# EasyEDA Pro project stm32最小系统板.eprj

# Schematic Schematic1
Create Date: 2024-04-08; Page Name: P1; Project Name: stm32最小系统板; Schematic Name: Schematic1; Update Date: 2024-06-23; Company: 无; Page Size: A4; Version: V1.0
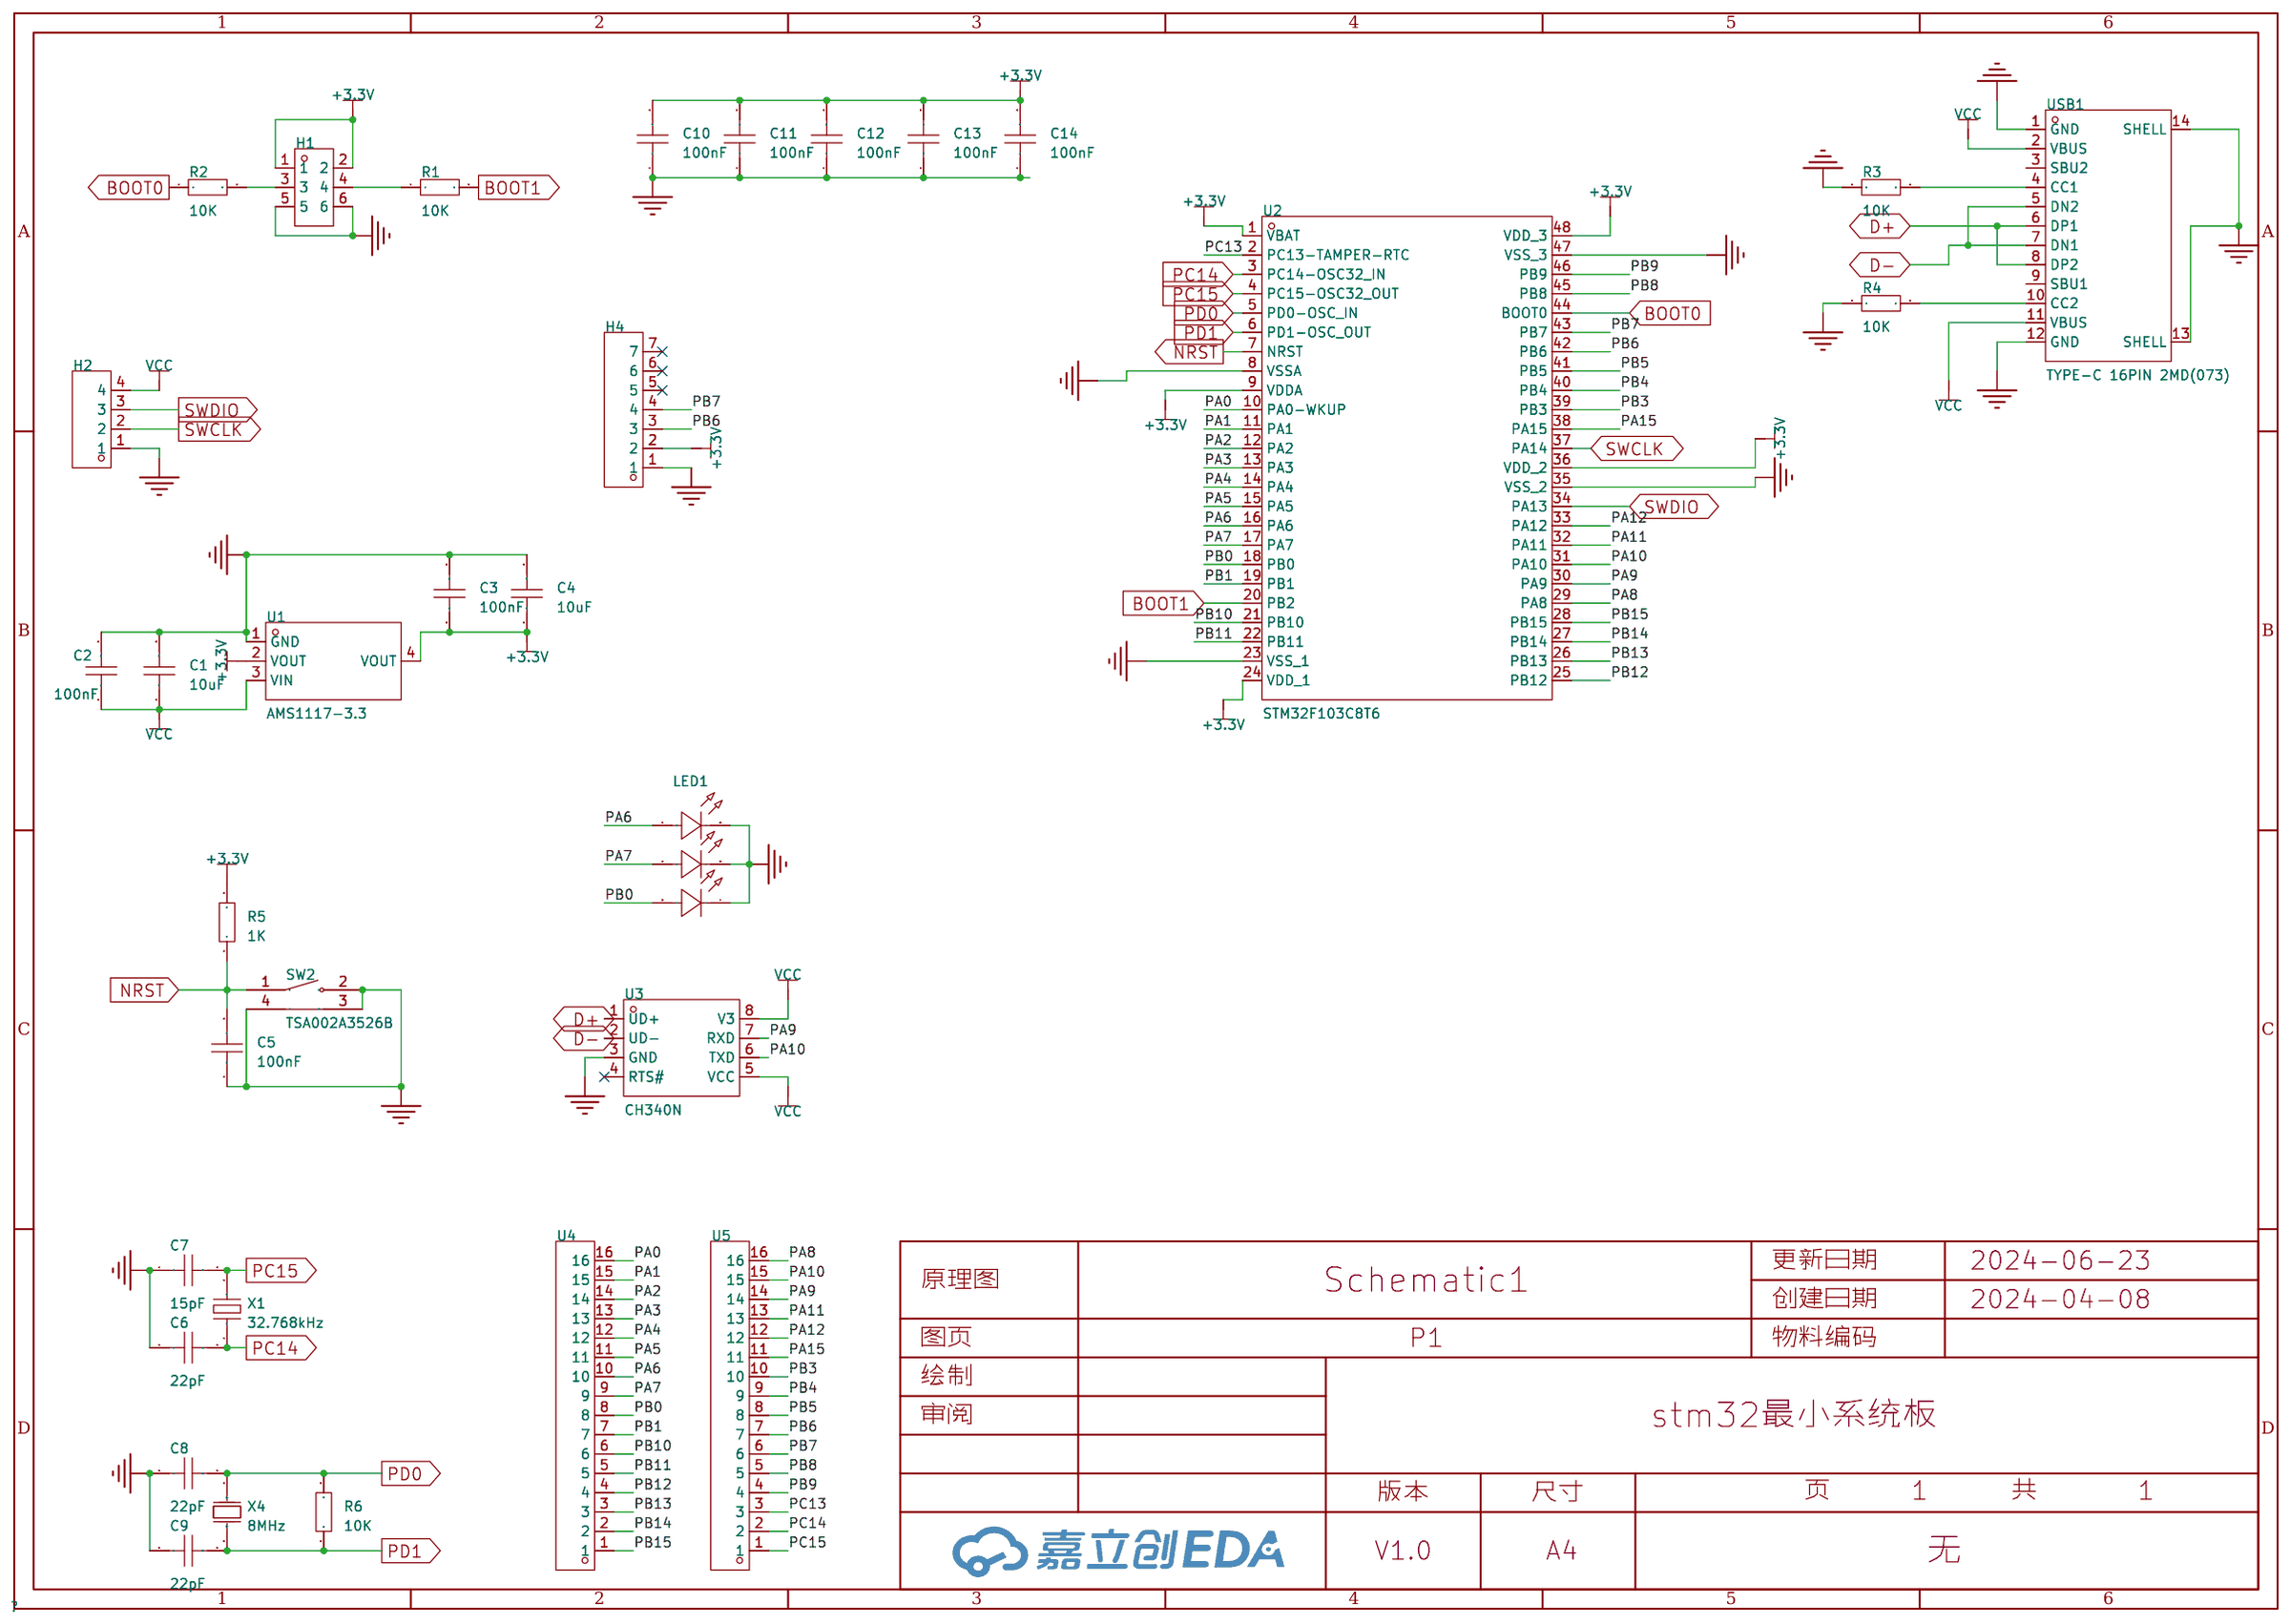
[diagram p0: schematic sheet]

## Parts
C1  10uF  [C0603]
C2  100nF  [C0603]
C3  100nF  [C0603]
C4  10uF  [C0603]
C5  100nF  [C0603]
C6  22pF  [C0603]
C7  15pF  [C0603]
C8  22pF  [C0603]
C9  22pF  [C0603]
C10  100nF  [C0603]
C11  100nF  [C0603]
C12  100nF  [C0603]
C13  100nF  [C0603]
C14  100nF  [C0603]
H1  PZ254V-12-6P  [HDR-TH_6P-P2.54-V-M-R2-C3-S2.54]
H2  PZ254V-11-04P  [HDR-TH_4P-P2.54-V-M]
H4  PZ254V-11-07P  [HDR-TH_7P-P2.54-V-M]
LED1  TC5050RGBF08-3CJH-AF53A  [LED-SMD_6P-L5.0-W5.0-TL_TC5050RGBF08]
R1  10K  [R0603]
R2  10K  [R0603]
R3  10K  [R0603]
R4  10K  [R0603]
R5  1K  [R0603]
R6  10K  [R0603]
SW2  TSA002A3526B  [SW-SMD_TSA245G00D-250]
U1  AMS1117-3.3  [SOT-223-3_L6.5-W3.4-P2.30-LS7.0-BR]
U2  STM32F103C8T6  [LQFP-48_L7.0-W7.0-P0.50-LS9.0-BL]
U3  CH340N  [SOP-8_L4.9-W3.9-P1.27-LS6.0-BL]
U4  ZX-PZ2.54-1-16PZZ  [HDR-TH_16P-P2.54-V-M-2]
U5  ZX-PZ2.54-1-16PZZ  [HDR-TH_16P-P2.54-V-M-2]
USB1  TYPE-C 16PIN 2MD(073)  [USB-C-SMD_TYPE-C-6PIN-2MD-073]
X1  32.768kHz  [OSC-SMD_L3.2-W1.5]
X4  8MHz  [CRYSTAL-SMD_L11.5-W4.8-LS12.7]

## Library data of the parts
C1-C14 = CAP_0603: Supplier Footprint: 0603
H1 = PZ254V-12-6P: 插针结构:2x3P;间距:2.54mm;行距:2.54mm;圆针/方针:方针;安装类型:直插;排数:双排;总PIN位数:6P;额定电流:-;额定电压:-;配合针长度:6mm;塑高:2.5mm;端接针长度:3mm;触头材质:黄铜;触头镀层:-;工作温度范围:-40℃~+105℃;颜色:黑色;; LCSC Part Name: 间距:2.54mm 2x3P 直插 方针; Supplier Part: C492420; Manufacturer: XFCN(兴飞); Supplier Footprint: 插件,P=2.54mm; JLCPCB Part Class: 扩展库; Datasheet: https://atta.szlcsc.com/upload/public/pdf/source/20200309/C492420_BAECB307B001054C09D200388220EAE6.pdf; Supplier: LCSC; Pin Structure: 2x3P; Pitch: 2.54mm; Row Spacing: 2.54mm; Circluar Pins/Square Pins: 方针; Mounting Type: 直插; Number of Rows: 双排; Number of Pins: 6P; Length of Mating Pin: 6mm; Insulation Height: 2.5mm; Length of End Connection Pin: 3mm; Contact Material: 黄铜; Operating Temperature Range: -40℃~+105℃; Color: 黑色
H2 = PZ254V-11-04P: 插针结构:1x4P;间距:2.54mm;行距:-;圆针/方针:方针;安装类型:直插;排数:单排;总PIN位数:4P;额定电流:3A;额定电压:250V;配合针长度:6mm;塑高:2.5mm;端接针长度:3mm;触头材质:-;工作温度范围:-40℃~+105℃;颜色:黑色;; LCSC Part Name: 间距:2.54mm 1x4P 直插 方针; Supplier Part: C2691448; Manufacturer: XFCN(兴飞); Supplier Footprint: 插件,P=2.54mm; JLCPCB Part Class: 扩展库; Datasheet: https://atta.szlcsc.com/upload/public/pdf/source/20200309/C492403_F9F19131791D08044AD4F84F8E751A34.pdf; Supplier: LCSC; Pin Structure: 1x4P; Pitch: 2.54mm; Circluar Pins/Square Pins: 方针; Mounting Type: 直插; Number of Rows: 单排; Number of Pins: 4P; Current Rating (Max): 3A; Voltage Rating (Max): 250V; Length of Mating Pin: 6mm; Insulation Height: 2.5mm; Length of End Connection Pin: 3mm; Operating Temperature Range: -40℃~+105℃; Color: 黑色
H4 = PZ254V-11-07P: 插针结构:1x7P;间距:2.54mm;行距:-;圆针/方针:方针;安装类型:直插;排数:单排;总PIN位数:7P;额定电流:-;额定电压:-;配合针长度:6mm;塑高:2.5mm;端接针长度:3mm;触头材质:黄铜;触头镀层:-;工作温度范围:-40℃~+105℃;颜色:黑色;; LCSC Part Name: 间距:2.54mm 1x7P 直插 方针; Supplier Part: C492406; Manufacturer: XFCN(兴飞); Supplier Footprint: 插件,P=2.54mm; JLCPCB Part Class: 扩展库; Datasheet: https://atta.szlcsc.com/upload/public/pdf/source/20200309/C492406_654C533EE691117E22DD9F76C114C2D9.pdf; Supplier: LCSC; Pin Structure: 1x7P; Pitch: 2.54mm; Circluar Pins/Square Pins: 方针; Mounting Type: 直插; Number of Rows: 单排; Number of Pins: 7P; Length of Mating Pin: 6mm; Insulation Height: 2.5mm; Length of End Connection Pin: 3mm; Contact Material: 黄铜; Operating Temperature Range: -40℃~+105℃; Color: 黑色
LED1 = TC5050RGBF08-3CJH-AF53A: LED贴片5050RGB灯珠高亮红绿蓝三色0.2W; LCSC Part Name: RGB三色; Supplier Part: C784540; Manufacturer: TCWIN(天成); Supplier Footprint: SMD5050; JLCPCB Part Class: 扩展库; Datasheet: https://atta.szlcsc.com/upload/public/pdf/source/20230731/34B1F7048EB892D234C2083EEE9FB085.pdf; Supplier: LCSC
R1-R6 = Res_0603: Supplier Footprint: 0603
SW2 = TSA002A3526B: 按钮形状:矩形按钮;安装方式:卧贴;开关长度:4.8mm;开关宽度:2mm;开关高度:3.5mm;触点电流:50mA;额定电压(AC):-;额定电压(DC):12V;机械寿命:-;; LCSC Part Name: 4.8*2*3.5mm 卧贴 轻触开关; Supplier Part: C2846758; Manufacturer: BZCN(博众电气); Supplier Footprint: SMD; JLCPCB Part Class: 扩展库; Datasheet: https://atta.szlcsc.com/upload/public/pdf/source/20210716/C2846758_C5F360C9DCDCC61DC9DF63762F3BD866.pdf; Supplier: LCSC; Actuator Style: 矩形按钮; Mounting Style: 卧贴; Switch Length: 4.8mm; Switch Width: 2mm; Switch Height: 3.5mm; Contact Current: 50mA; Voltage Rating (DC): 12V
U1 = AMS1117-3.3_C6186: 输出类型:固定;最大输入电压:-;输出电压:3.3V;最大输出电流:1A;电源纹波抑制比(PSRR):72dB@(120Hz);输出极性:正极;; LCSC Part Name: 输出3.3V 1A; Supplier Part: C6186; Manufacturer: AMS; Supplier Footprint: SOT-223; JLCPCB Part Class: 基础库; Datasheet: https://atta.szlcsc.com/upload/public/pdf/source/20180727/C6186_7A095716F0823C02F1997A905E26C086.pdf; Supplier: LCSC; Output Type: 固定; Output Voltage: 3.3V; MAX Output Current: 1A; Power Supply Rejection Ratio (PSRR): 72dB@(120Hz); Dropout Voltage: 1.3V@(800mA); Output Polarity: 正极; Number of Outputs: 1
U2 = STM32F103C8T6: CPU内核:ARM-M3;程序存储容量:64KB;RAM总容量:20KB;GPIO端口数量:37;工作电压范围:2V~3.6V;CPU最大主频:72MHz;程序存储器类型:FLASH;; Supplier Part: C8734; Manufacturer: ST(意法半导体); Supplier Footprint: LQFP-48(7x7); JLCPCB Part Class: 扩展库; Datasheet: https://atta.szlcsc.com/upload/public/pdf/source/20220812/8363ACEC51AD55ECEB84799464F7CB85.pdf; Supplier: LCSC; CPU Core: ARM-M3; Program Storage Size: 64KB; RAM Size: 20KB; GPIO Ports Number: 37; Operating Voltage Range: 2V~3.6V; CPU Maximum Speed: 72MHz; Program Memory Type: FLASH; Operating Temperature Range: -40℃~+85℃; ADC (Bit): 12bit; Universal Serial Bus: 有; Peripheral/Function: 看门狗；DMA；看门狗；温度传感器; Watchdog: 有; Infrared Data Association: 有; Low-Voltage Detect: 有; Direct Memory Access: 有; Internal Oscillator: 有
U3 = CH340N: LCSC Part Name: USB转串口芯片 CH340; Supplier Part: C2977777; Manufacturer: WCH(南京沁恒); Supplier Footprint: SOP-8; JLCPCB Part Class: 扩展库; Datasheet: https://atta.szlcsc.com/upload/public/pdf/source/20230530/6E401E9554E9F5311886CC8B3F89B62E.pdf; Supplier: LCSC
U4 U5 = ZX-PZ2.54-1-16PZZ: 插针结构:1x16P;间距:2.54mm;行距:-;圆针/方针:方针;安装类型:直插;排数:单排;总PIN位数:16P;额定电流:3A;额定电压:1kV;配合针长度:6mm;塑高:2.5mm;端接针长度:3mm;触头材质:黄铜;触头镀层:金;工作温度范围:-40℃~+105℃;焊接温度(最大值):-;颜色:黑色;; LCSC Part Name: 1x16P 间距:2.54mm 方针 直插; Supplier Part: C7501270; Manufacturer: Megastar(兆星); Supplier Footprint: 插件,P=2.54mm; JLCPCB Part Class: 扩展库; Datasheet: https://atta.szlcsc.com/upload/public/pdf/source/20231122/E454B24BEC0C004E7BA34E686CD1994E.pdf; Supplier: LCSC; Pin Structure: 1x16P; Pitch: 2.54mm; Circluar Pins/Square Pins: 方针; Mounting Type: 直插; Number of Rows: 单排; Number of Pins: 16P; Current Rating (Max): 3A; Voltage Rating (Max): 1kV; Length of Mating Pin: 6mm; Insulation Height: 2.5mm; Length of End Connection Pin: 3mm; Contact Material: 黄铜; Contact Plating: 金; Operating Temperature Range: -40℃~+105℃; Color: 黑色
USB1 = TYPE-C 16PIN 2MD(073): 连接器类型:Type-C;标准:-;公母:母;端口数量:1;触点数量:16P;安装方式:卧贴;额定电流 - 电源:5A;工作温度范围:-25℃~+85℃;; LCSC Part Name: Type-C 母 卧贴; Supplier Part: C2765186; Manufacturer: SHOU HAN(首韩); Supplier Footprint: SMD; JLCPCB Part Class: 扩展库; Datasheet: https://atta.szlcsc.com/upload/public/pdf/source/20211123/39B17C16241EAC15C5E277BDA434118E.pdf; Supplier: LCSC; Connector Type: Type-C; Gender: 母; Number of Ports: 1; Number of Contacts: 16P; Mounting Style: 卧贴; Current Rating - Power (Max): 5A; Operating Temperature Range: -25℃~+85℃
X1 = X321532768KGD2SI: 晶振类型:贴片晶振;频率:32.768kHz;常温频差:±20ppm;外接负载电容:12.5pF;频率稳定度(全温):-;; LCSC Part Name: 32.768kHz ±20ppm 12.5pF; Supplier Part: C620155; Manufacturer: YXC(扬兴晶振); Supplier Footprint: SMD3215-2P; JLCPCB Part Class: 扩展库; Datasheet: https://atta.szlcsc.com/upload/public/pdf/source/20240329/3A7650FD985DD0DE85694D3785AB4916.pdf; Supplier: LCSC; Crystal Type: 贴片晶振; Normal temperature Frequency Tolerance: ±20ppm; External load capacitor: 12.5pF; Operating Temperature: -40℃~+85℃
X4 = X49SM8MSD2SC: 晶振类型:贴片晶振;频率:8MHz;常温频差:±20ppm;外接负载电容:20pF;频率稳定度(全温):±30ppm;; LCSC Part Name: 8MHz ±20ppm 20pF; Supplier Part: C12674; Manufacturer: YXC(扬兴晶振); Supplier Footprint: HC-49S-SMD; JLCPCB Part Class: 基础库; Datasheet: https://atta.szlcsc.com/upload/public/pdf/source/20240329/3EBF42EBCAB50CA65B6FA9D7CFA1955A.pdf; Supplier: LCSC; Crystal Type: 贴片晶振; Normal temperature Frequency Tolerance: ±20ppm; External load capacitor: 20pF; Frequency Stability(Full temperature range): ±30ppm; Operating Temperature: -20℃~+70℃

## Nets
+3.3V: C3.1 C4.1 C10.2 C11.2 C12.2 C13.2 C14.2 H1.1 H1.2 H4.2 R5.2 U1.2(VOUT) U1.4(VOUT) U2.1(VBAT) U2.9(VDDA) U2.24(VDD_1) U2.36(VDD_2) U2.48(VDD_3)
GND: C1.2 C2.2 C3.2 C4.2 C5.1 C6.1 C7.1 C8.1 C9.1 C10.1 C11.1 C12.1 C13.1 C14.1 H1.5 H1.6 H2.1 H4.1 LED1.4(-) LED1.5(-) LED1.6(-) R3.1 R4.1 SW2.2 SW2.3 SW2.4 U1.1(GND) U2.8(VSSA) U2.23(VSS_1) U2.35(VSS_2) U2.47(VSS_3) U3.3(GND) USB1.1(GND) USB1.12(GND) USB1.13(SHELL) USB1.14(SHELL)
VCC: C1.1 C2.1 H2.4 U1.3(VIN) U3.5(VCC) U3.8(V3) USB1.2(VBUS) USB1.11(VBUS)
BOOT0: R2.1 U2.44(BOOT0)
BOOT1: R1.2 U2.20(PB2)
D+: U3.1(UD+) USB1.6(DP1) USB1.8(DP2)
D-: U3.2(UD-) USB1.5(DN2) USB1.7(DN1)
NRST: C5.2 R5.1 SW2.1 U2.7(NRST)
PA0: U2.10(PA0-WKUP) U4.16
PA1: U2.11(PA1) U4.15
PA2: U2.12(PA2) U4.14
PA3: U2.13(PA3) U4.13
PA4: U2.14(PA4) U4.12
PA5: U2.15(PA5) U4.11
PA6: LED1.1(+) U2.16(PA6) U4.10
PA7: LED1.2(+) U2.17(PA7) U4.9
PA8: U2.29(PA8) U5.16
PA9: U2.30(PA9) U3.7(RXD) U5.14
PA10: U2.31(PA10) U3.6(TXD) U5.15
PA11: U2.32(PA11) U5.13
PA12: U2.33(PA12) U5.12
PA15: U2.38(PA15) U5.11
PB0: LED1.3(+) U2.18(PB0) U4.8
PB1: U2.19(PB1) U4.7
PB3: U2.39(PB3) U5.10
PB4: U2.40(PB4) U5.9
PB5: U2.41(PB5) U5.8
PB6: H4.3 U2.42(PB6) U5.7
PB7: H4.4 U2.43(PB7) U5.6
PB8: U2.45(PB8) U5.5
PB9: U2.46(PB9) U5.4
PB10: U2.21(PB10) U4.6
PB11: U2.22(PB11) U4.5
PB12: U2.25(PB12) U4.4
PB13: U2.26(PB13) U4.3
PB14: U2.27(PB14) U4.2
PB15: U2.28(PB15) U4.1
PC13: U2.2(PC13-TAMPER-RTC) U5.3
PC14: C6.2 U2.3(PC14-OSC32_IN) U5.2 X1.1
PC15: C7.2 U2.4(PC15-OSC32_OUT) U5.1 X1.2
PD0: C8.2 R6.2 U2.5(PD0-OSC_IN) X4.1(OSC1)
PD1: C9.2 R6.1 U2.6(PD1-OSC_OUT) X4.2(OSC2)
SWCLK: H2.2 U2.37(PA14)
SWDIO: H2.3 U2.34(PA13)
$1N1260: H1.4 R1.1
$1N1311: H1.3 R2.2
$1N2229: R3.2 USB1.4(CC1)
$1N2235: R4.2 USB1.10(CC2)

Not connected (* = marked no-connect by the designer): H4 5* 6* 7*; U3 4(RTS#)*; USB1 3(SBU2) 9(SBU1)

# Board PCB4
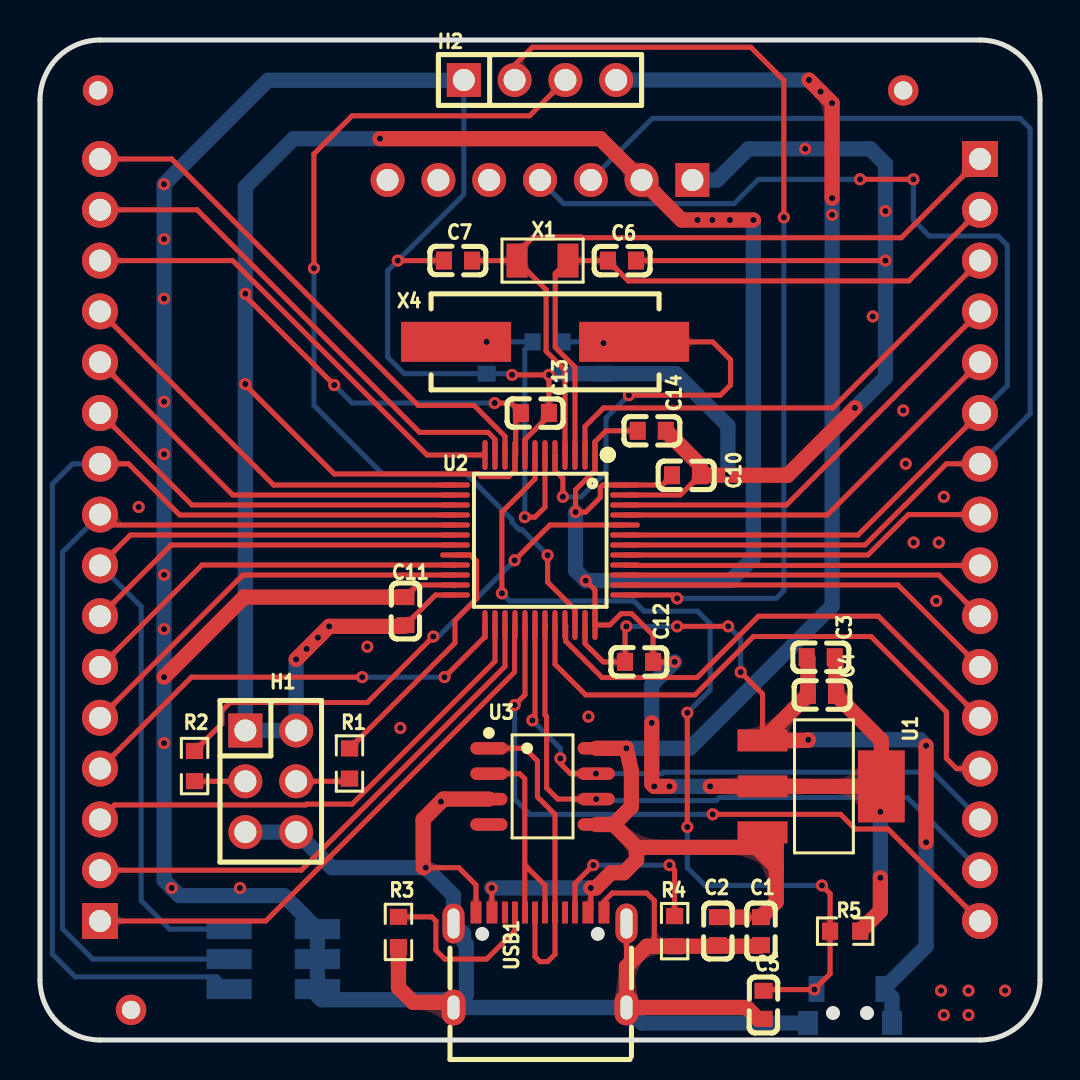
[diagram p1: board, top side]
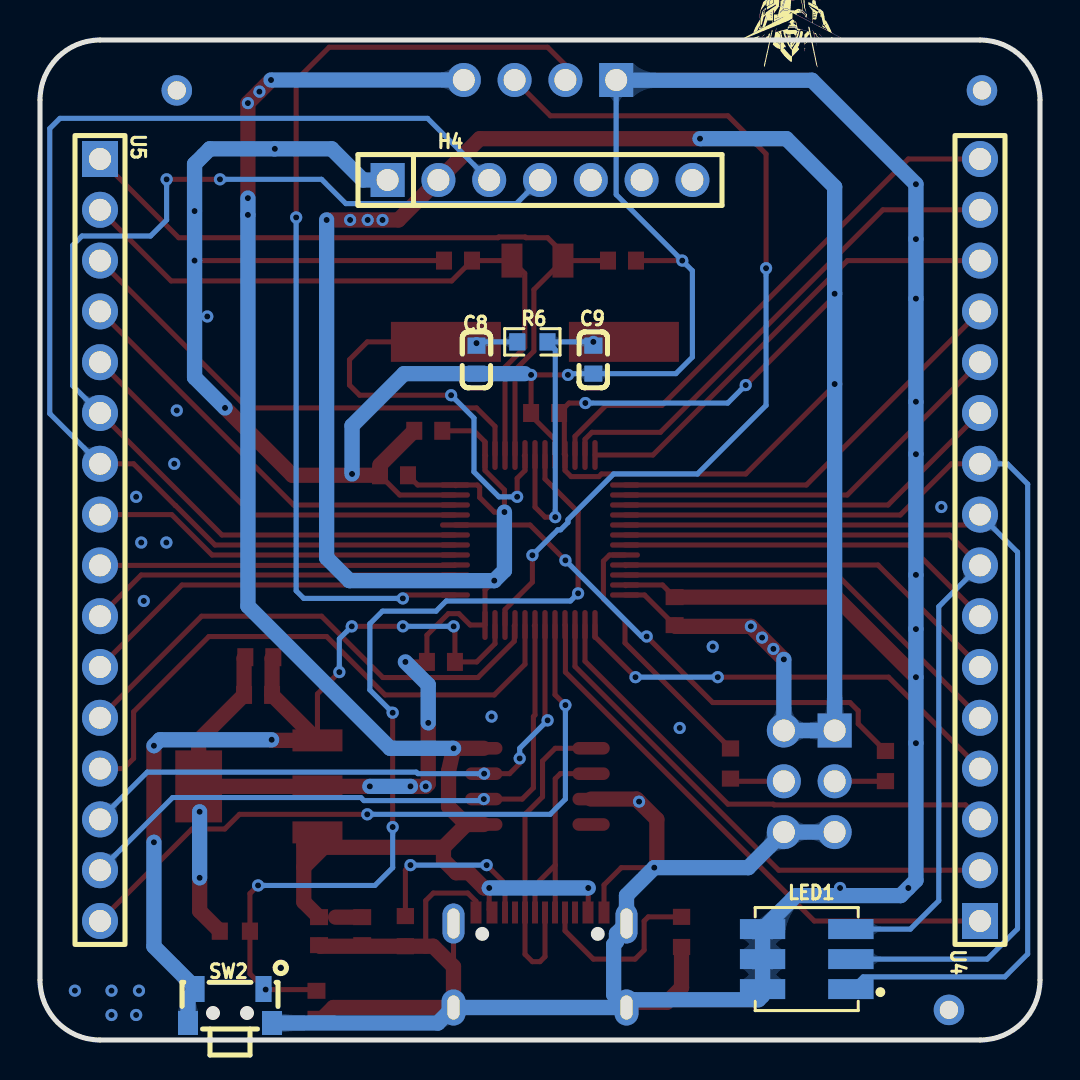
[diagram p2: board, bottom side, seen from below]

Outline 50 x 50 mm; copper layers: Top Layer, Bottom Layer. Coordinates in mm from the lower left corner of the outline.
Outline path: 0,47 0,3 arc(0.88,0.88) 3,0 47,0 arc(49.12,0.88) 50,3 50,47 arc(49.12,49.12) 47,50 3,50 arc(0.88,49.12) 0,47
Stack: Top Layer 0.035mm / Dielectric1 1.51mm FR4 er 4.5 / Bottom Layer 0.035mm

## Design rules (mm)
template: 自定义配置
spacing copperThickness1oz (default): track to track 0.203, other pairs 0.203 to 0.203
spacing copperThickness2oz: track to track 0.203, other pairs 0.152 to 0.3
track width trackWidth (default): min 0.254, default 0.254, max 0.762
track width VCC and GND: min 0.254, default 0.762, max 0.762
differential pair differentialPair (default): width min 0.127, default 0.254, max 2.54; gap min 0.152, default 0.152
via viaSize (default): diameter min 0.5, default 0.61, max 10; hole min 0.3, default 0.305, max 6.299
net +3.3V uses VCC and GND
net GND uses VCC and GND
net VCC uses VCC and GND

## Placement (name value [footprint] x y rotation side)
C1  10uF  [C0603]  36.05 5.44 270 top
C2  100nF  [C0603]  33.89 5.44 270 top
C3  100nF  [C0603]  39.03 19.14 180 top
C4  10uF  [C0603]  39.1 17.25 180 top
C5  100nF  [C0603]  36.18 1.76 90 top
C6  22pF  [C0603]  29.1 38.97 180 top
C7  15pF  [C0603]  20.9 38.97 0 top
C8  22pF  [C0603]  28.18 34.02 90 bottom
C9  22pF  [C0603]  22.33 34.02 90 bottom
C10  100nF  [C0603]  32.3 28.24 180 top
C11  100nF  [C0603]  18.27 21.44 270 top
C12  100nF  [C0603]  29.95 18.9 0 top
C13  100nF  [C0603]  24.75 31.35 180 top
C14  100nF  [C0603]  30.59 30.46 180 top
H1  PZ254V-12-6P  [HDR-TH_6P-P2.54-V-M-R2-C3-S2.54]  11.54 12.94 270 top
H2  PZ254V-11-04P  [HDR-TH_4P-P2.54-V-M]  25 48 0 top
H4  PZ254V-11-07P  [HDR-TH_7P-P2.54-V-M]  25 43 180 bottom
LED1  TC5050RGBF08-3CJH-AF53A  [LED-SMD_6P-L5.0-W5.0-TL_TC5050RGBF08]  11.66 4.04 0 bottom
NOREF  -  [Pad_e16616]  43.16 47.48 0 top
NOREF#2  -  [Pad_e16695]  2.9 47.48 0 top
NOREF#3  -  [Pad_e16697]  4.55 1.5 0 top
R1  10K  [R0603]  15.47 13.82 90 top
R2  10K  [R0603]  7.73 13.7 270 top
R3  10K  [R0603]  17.92 5.4 90 top
R4  10K  [R0603]  31.73 5.44 90 top
R5  1K  [R0603]  40.26 5.44 0 top
R6  10K  [R0603]  25.38 34.91 0 bottom
SW2  TSA002A3526B  [SW-SMD_TSA245G00D-250]  40.5 1.7 0 bottom
U1  AMS1117-3.3  [SOT-223-3_L6.5-W3.4-P2.30-LS7.0-BR]  39.1 12.68 180 top
U2  STM32F103C8T6  [LQFP-48_L7.0-W7.0-P0.50-LS9.0-BL]  25 25 180 top
U3  CH340N  [SOP-8_L4.9-W3.9-P1.27-LS6.0-BL]  25.13 12.68 270 top
U4  ZX-PZ2.54-1-16PZZ  [HDR-TH_16P-P2.54-V-M-2]  3 25 90 bottom
U5  ZX-PZ2.54-1-16PZZ  [HDR-TH_16P-P2.54-V-M-2]  47 25 270 bottom
USB1  TYPE-C 16PIN 2MD(073)  [USB-C-SMD_TYPE-C-6PIN-2MD-073]  25 4 0 top
X1  32.768kHz  [OSC-SMD_L3.2-W1.5]  25.13 38.97 180 top
X4  8MHz  [CRYSTAL-SMD_L11.5-W4.8-LS12.7]  25.25 34.91 180 top

## Footprints (pads in the part's own frame, mm; a bottom-side part is the same pattern mirrored in y, then rotated)
C0603
  rect 0.8x0.9 smd: 1(-0.7,0) 2(0.7,0)
CRYSTAL-SMD_L11.5-W4.8-LS12.7
  rect 5.5x2 smd: 1(-4.45,0) 2(4.45,0)
HDR-TH_4P-P2.54-V-M
  rect 1.7x1.7 hole 1.1: 1(-3.81,0)
  round 1.7 hole 1.1: 2(-1.27,0) 3(1.27,0) 4(3.81,0)
HDR-TH_6P-P2.54-V-M-R2-C3-S2.54
  rect 1.7x1.7 hole 1.1: 1(-2.54,-1.27)
  round 1.7 hole 1.1: 2(-2.54,1.27) 3(0,-1.27) 4(0,1.27) 5(2.54,-1.27) 6(2.54,1.27)
HDR-TH_7P-P2.54-V-M
  rect 1.7x1.7 hole 1.1: 1(-7.62,0)
  round 1.7 hole 1.1: 2(-5.08,0) 3(-2.54,0) 4(0,0) 5(2.54,0) 6(5.08,0) 7(7.62,0)
HDR-TH_16P-P2.54-V-M-2
  rect 1.8x1.8 hole 1.1: 1(-19.05,0)
  round 1.8 hole 1.1: 2(-16.51,0) 3(-13.97,0) 4(-11.43,0) 5(-8.89,0) 6(-6.35,0) 7(-3.81,0) 8(-1.27,0) 9(1.27,0) 10(3.81,0) 11(6.35,0) 12(8.89,0) 13(11.43,0) 14(13.97,0) 15(16.51,0) 16(19.05,0)
LED-SMD_6P-L5.0-W5.0-TL_TC5050RGBF08
  rect 2.265x1 smd: 1(-2.208,1.5) 2(-2.208,0) 3(-2.208,-1.5) 4(2.208,-1.5) 5(2.208,0) 6(2.208,1.5)
LQFP-48_L7.0-W7.0-P0.50-LS9.0-BL
  oval 0.27x1.5 smd: 1(-2.75,-4.25) 2(-2.25,-4.25) 3(-1.75,-4.25) 4(-1.25,-4.25) 5(-0.75,-4.25) 6(-0.25,-4.25) 7(0.25,-4.25) 8(0.75,-4.25) 9(1.25,-4.25) 10(1.75,-4.25) 11(2.25,-4.25) 12(2.75,-4.25) 25(2.75,4.25) 26(2.25,4.25) 27(1.75,4.25) 28(1.25,4.25) 29(0.75,4.25) 30(0.25,4.25) 31(-0.25,4.25) 32(-0.75,4.25) 33(-1.25,4.25) 34(-1.75,4.25) 35(-2.25,4.25) 36(-2.75,4.25)
  oval 1.5x0.27 smd: 13(4.25,-2.75) 14(4.25,-2.25) 15(4.25,-1.75) 16(4.25,-1.25) 17(4.25,-0.75) 18(4.25,-0.25) 19(4.25,0.25) 20(4.25,0.75) 21(4.25,1.25) 22(4.25,1.75) 23(4.25,2.25) 24(4.25,2.75) 37(-4.25,2.75) 38(-4.25,2.25) 39(-4.25,1.75) 40(-4.25,1.25) 41(-4.25,0.75) 42(-4.25,0.25) 43(-4.25,-0.25) 44(-4.25,-0.75) 45(-4.25,-1.25) 46(-4.25,-1.75) 47(-4.25,-2.25) 48(-4.25,-2.75)
OSC-SMD_L3.2-W1.5
  rect 1.05x1.7 smd: 1(-1.275,0) 2(1.275,0)
Pad_e16616
  round 1.524 hole 0.914: 49(0,0)
Pad_e16695
  round 1.524 hole 0.914: 50(0,0)
Pad_e16697
  round 1.524 hole 0.914: 51(0,0)
R0603
  rect 0.806x0.864 smd: 1(-0.753,0) 2(0.753,0)
SOP-8_L4.9-W3.9-P1.27-LS6.0-BL
  oval 0.63x1.865 smd: 1(-1.905,-2.683) 2(-0.635,-2.683) 3(0.635,-2.683) 4(1.905,-2.683) 5(1.905,2.683) 6(0.635,2.683) 7(-0.635,2.683) 8(-1.905,2.683)
SOT-223-3_L6.5-W3.4-P2.30-LS7.0-BR
  rect 2.5x1.1 smd: 1(2.97,-2.3) 2(2.97,0) 3(2.97,2.3)
  rect 2.34x3.6 smd: 4(-2.97,0)
SW-SMD_TSA245G00D-250
  rect 0.8x1.3 smd: 1(-1.675,-0.85) 2(1.675,-0.85)
  rect 1x1.2 smd: 3(2.1,0.85) 4(-2.1,0.85)
USB-C-SMD_TYPE-C-6PIN-2MD-073
  rect 0.55x1.1 smd: 1(-3.2,2.375) 2(-2.4,2.375) 11(2.4,2.375) 12(3.2,2.375)
  rect 0.3x1.1 smd: 3(-1.75,2.375) 4(-1.25,2.375) 5(-0.75,2.375) 6(-0.25,2.375) 7(0.25,2.375) 8(0.75,2.375) 9(1.25,2.375) 10(1.75,2.375)
  oval 1.1x2 hole 0.6x1.5: 13(-4.325,1.825) 14(4.325,1.825)
  oval 1.2x1.8 hole 0.6x1.2: 13(-4.325,-2.375) 14(4.325,-2.375)

## Nets
As in the schematic, except:
GND: C1.2 C2.2 C3.2 C4.2 C5.1 C6.1 C7.1 C8.1 C9.1 C10.1 C11.1 C12.1 C13.1 C14.1 H1.5 H1.6 H2.1 H4.1 LED1.4 LED1.5 LED1.6 NOREF.49 NOREF#2.50 NOREF#3.51 R3.1 R4.1 SW2.2 SW2.3 SW2.4 U1.1 U2.8 U2.23 U2.35 U2.47 U3.3 USB1.1 USB1.12 USB1.13 USB1.14

Pads without a net: H4 5 6 7; U3 4; USB1 3 9

## Via types
v1: diameter 0.61, hole 0.305, Top Layer to Bottom Layer, 102 vias

## Routing (per net, layer and track width the routed paths; a pad name or vN(x,y) marks a point on that pad's centre or on a via; arc(x,y) is an arc through that point)
+3.3V: length 187.4
  Top Layer w0.254: 10.27,32.75 14.71,28.3 21.93,28.3 22.06,28.17 23.44,28.17 23.75,28.48 U2.9 ; U2.24 19.78,22.25 C11.2 ; U2.1 27.75,29.91 28.3,30.46 C14.2 ; U2.1 27.72,29.22 ; U2.1 27.75,28.48 26.78,27.5 v1(26.78,26.4) 27.29,26.4 28.02,27.13 28.02,27.64 28.13,27.75 U2.48 ; U2.9 23.78,29.28 23.78,31.09 C13.2 23.55,31.85 v1(22.73,31.85) ; U2.9 23.72,29.22 ; U2.48 29.22,27.72 ; U2.48 31.11,27.75 C10.2 ; v1(27.29,22.97) 27.75,22.5 U2.36 28.49,20.75 29.06,21.32 29.58,21.32 30.65,20.25 C12.2 v1(31.73,18.9) ; v1(14.71,32.75) 10.27,37.19
  Top Layer w0.762: v1(33.51,12.68) U1.2 U1.4 42.07,14.98 C4.1 39.8,19.08 39.74,19.14 ; v1(30.59,15.86) 30.59,12.81 v1(30.72,12.68) v1(31.48,12.68) ; v1(42.02,8.11) 42.02,6.45 41.01,5.44 ; v1(35.67,41) v1(34.5,41) v1(33.61,41) v1(32.87,41) 32.08,41 H4.2 28.01,45.07 v1(17,45.07) ; C11.2 18.21,20.68 v1(14.46,20.68) v1(13.9,20.12) v1(13.33,19.55) v1(12.81,19.03)
  Bottom Layer w0.254: v1(22.73,31.85) 15.61,31.85 v1(14.71,32.75)
  Bottom Layer w0.762: v1(31.48,12.68) v1(33.51,12.68) ; v1(17,45.07) 12.68,45.07 10.27,42.65 v1(10.27,37.31) v1(10.27,32.8) H1.1 H1.2 v1(12.81,19.03) ; v1(35.67,41) 35.67,24.11 34.53,22.97 v1(27.29,22.97) 26.78,23.48 v1(26.78,26.4) ; v1(30.59,15.86) 30.59,17.76 v1(31.73,18.9) ; v1(42.02,11.41) v1(42.02,8.11)
GND: length 302.9
  Top Layer w0.254: C10.1 32.01,27.25 U2.47 ; USB1.12 28.2,6.93 28.61,7.35 30.33,7.35 30.72,6.97 30.72,4.69 30.71,4.69 ; v1(31.86,20.68) v1(34.41,20.68) ; USB1.1 21.8,7.75 20.94,8.62 v1(19.28,8.62) ; v1(29.32,20.68) 29.25,20.62 C12.1 28.16,18.9 27.25,19.82 U2.35 ; C7.1 v1(17.89,38.97) ; 20.72,22.72 U2.23 18.88,22.75 C11.1 ; USB1.14 29.32,3.67 ; U2.8 24.25,30.02 25.45,31.22 C13.1 25.45,33.06 25.25,33.25 v1(23.6,33.25) ; v1(42.27,38.97) C6.1 ; v1(35.03,18.4) 36.13,17.3 36.13,14.98
  Top Layer w0.762: 19.16,8.62 19.16,11.03 v1(20.05,11.92) 20.17,12.05 U3.3 ; USB1.13 20.41,1.89 18.66,1.89 17.92,2.62 R3.1 ; v1(38.42,15.01) 38.39,14.98 U1.1 ; C3.2 38.4,19.08 38.4,17.25 36.13,14.98 ; v1(44.3,14.71) v1(44.3,9.89) ; C11.1 10.21,22.14 v1(6.2,18.14) ; C5.1 35.9,1.06 35.33,1.62 USB1.14 29.32,3.67 30.34,4.69 R4.1 36,4.69 C1.2 ; C14.1 33,28.75 C10.1 37.38,28.24 v1(40.75,31.6)
  Bottom Layer w0.254: v1(29.32,20.68) v1(31.86,20.68) ; v1(35.03,18.4) 35.03,20.06 v1(34.41,20.68) ; v1(23.6,33.25) 23.54,33.32 C9.1 18.21,33.32 17.38,34.14 17.38,38.46 v1(17.89,38.97) 21.19,42.27 H2.1
  Bottom Layer w0.762: USB1.13 21.32,2.27 21.32,4.78 21.18,4.92 21.18,5.32 USB1.13 20.68,7.23 v1(19.28,8.62) 14.59,8.62 H1.6 H1.5 ; USB1.13 20.29,2.01 14.08,2.01 13.87,2.22 LED1.5 LED1.4 12.2,7.22 6.97,7.22 v1(6.59,7.6) 6.2,7.98 v1(6.2,14.84) v1(6.2,18.14) v1(6.2,20.54) v1(6.2,23.26) v1(6.2,29.29) v1(6.2,31.91) v1(6.2,37.07) v1(6.2,40.04) v1(6.2,42.79) 11.4,47.99 21.18,47.99 H2.1 ; USB1.13 USB1.14 30.1,0.85 SW2.4 ; v1(34.4,28.3) 34.4,30.72 31.8,33.32 C8.1 25.76,33.32 ; H4.1 33.86,43 35.41,44.56 v1(38.26,44.56) 41.51,44.56 42.27,43.8 v1(42.27,41.45) v1(42.27,38.97) 42.27,33.13 v1(40.75,31.6) ; SW2.3 42.6,2.12 SW2.2 44.3,4.68 v1(44.3,9.89) ; v1(38.42,15.01) 44.01,15.01 v1(44.3,14.71)
  vias: v1(4.93,26.65) v1(10,7.6) v1(16.36,19.67) v1(18.01,15.6) v1(25.45,33.25) v1(27.42,16.17) v1(41.64,36.18) v1(43.16,31.48) v1(43.29,28.81) v1(43.68,24.87) v1(44.81,21.95) v1(44.94,24.87) v1(45.05,2.47) v1(45.19,27.16) v1(45.19,1.25) v1(46.43,2.47) v1(46.43,1.25) v1(48.26,2.47)
VCC: length 83.3
  Top Layer w0.254: v1(22.59,7.6) 22.59,6.39 USB1.2 ; v1(27.54,7.6) 27.54,6.51 USB1.11
  Top Layer w0.762: 35.22,6.14 C2.1 ; 28.68,10.78 29.83,9.63 ; 28.68,10.78 U3.5 ; 28.68,10.78 29.57,11.67 29.57,13.44 v1(29.32,14.59) U3.8 ; 29.83,9.63 35.82,9.63 ; 29.83,9.63 29.83,9 29.19,8.36 28.56,8.36 27.79,7.6 v1(27.54,7.6) ; 36.81,8.64 36.81,6.9 C1.1 ; 36.81,8.64 36.81,9.76 36.68,9.63 36.13,9.63 ; 36.81,8.64 35.82,9.63 ; 36.13,9.63 35.82,9.63 ; 36.13,9.63 U1.3 ; v1(38.45,48) v1(39.03,47.42) v1(39.6,46.84) v1(39.6,42.09)
  Bottom Layer w0.762: H2.4 v1(38.45,48) ; v1(39.6,42.09) v1(39.6,41.26) 39.6,21.7 32.49,14.59 v1(29.32,14.59) ; v1(27.54,7.6) v1(22.59,7.6)
BOOT0: length 26.6
  Top Layer w0.254: R2.1 9.09,15.81 9.09,16.46 9.5,16.87 16.36,16.87 v1(19.67,20.17) ; v1(23.73,23.98) 25.5,25.75 U2.44
  Bottom Layer w0.254: v1(23.73,23.98) 19.92,20.17 v1(19.67,20.17)
BOOT1: length 13.2
  Top Layer w0.254: R1.2 20.75,19.85 20.75,20.98 21.83,22.06 21.83,23.94 21.52,24.25 U2.20
D+: length 16.2
  Top Layer w0.254: USB1.6 24.75,4.17 25,3.92 25.38,3.92 25.75,4.29 USB1.8 25.75,11.28 24.87,12.16 24.87,13.95 24.24,14.59 U3.1
D-: length 11.4
  Top Layer w0.254: 24.24,8.74 25.25,7.73 USB1.7 ; 24.24,8.74 24.24,13.06 23.98,13.32 U3.2 ; 24.24,8.74 24.24,6.39 USB1.5
NRST: length 46.7
  Top Layer w0.254: v1(39.1,7.73) 39.5,7.32 R5.1 39.5,3.31 v1(38.72,2.52) 36.24,2.52 36.18,2.46 ; U2.7 24.75,28.05 23.09,26.4 v1(23.09,22.33) ; v1(32.37,10.65) v1(32.37,16.36)
  Bottom Layer w0.254: v1(23.09,22.33) 23.48,21.95 29.69,21.95 30.2,21.44 32.87,21.44 33.51,20.81 33.51,17.51 v1(32.37,16.36) ; v1(32.37,10.65) 32.37,8.62 33.25,7.73 v1(39.1,7.73)
PA0: length 26.9
  Top Layer w0.254: U4.16 6.59,44.05 18.9,31.73 21.7,31.73 23.25,30.18 U2.10
PA1: length 25.3
  Top Layer w0.254: U2.11 22.75,30.04 22.4,30.38 18.98,30.38 7.85,41.51 U4.15
PA2: length 23.3
  Top Layer w0.254: U4.14 9.63,38.97 19.35,29.25 U2.12
PA3: length 21.3
  Top Layer w0.254: U2.13 11.68,27.75 U4.13
PA4: length 20.5
  Top Layer w0.254: U4.12 9.64,27.25 U2.14
PA5: length 19.7
  Top Layer w0.254: U2.15 7.6,26.75 U4.11
PA6: length 54.7
  Top Layer w0.254: U4.10 4.43,28.81 6.99,26.25 U2.16
  Bottom Layer w0.254: U4.10 1.63,28.81 0.62,27.79 0.62,4.3 1.76,3.16 8.85,3.16 LED1.1
PA7: length 48.4
  Top Layer w0.254: U4.9 3.52,25.75 U2.17
  Bottom Layer w0.254: LED1.2 2.64,4.04 1.12,5.56 1.12,24.39 U4.9
PA8: length 34.7
  Top Layer w0.254: v1(23.73,16.75) 24.25,17.27 U2.29 ; U5.16 42.4,10.55 40.76,10.55 40.03,11.28 v1(33.64,11.28)
  Bottom Layer w0.254: v1(23.73,16.75) 23.73,12.05 24.49,11.28 v1(33.64,11.28)
PA9: length 29.8
  Top Layer w0.254: v1(24.62,15.98) 24.75,16.11 U2.30 ; v1(27.79,13.32) 26.52,13.32 26.02,13.82 v1(26.02,14.08)
  Bottom Layer w0.254: v1(27.79,13.32) 31.11,13.32 31.18,13.39 44.64,13.39 U5.14 ; v1(24.62,15.98) 26.02,14.59 v1(26.02,14.08)
PA10: length 31.7
  Top Layer w0.254: v1(27.81,12.05) 25.89,12.05 25.33,12.61 25.33,16.17 25.25,16.25 U2.31 25.28,20.72
  Bottom Layer w0.254: U5.15 43.37,12.12 33.96,12.12 33.8,11.97 27.89,11.97 v1(27.81,12.05)
PA11: length 29.2
  Top Layer w0.254: U2.32 25.75,18.79 27.29,17.25 32.75,17.25 35.67,20.17 41.56,20.17 45.32,16.41 45.32,14.08 45.83,13.57 U5.13
PA12: length 25.7
  Top Layer w0.254: U2.33 26.28,20.72 26.28,19.94 28.1,18.12 32.86,18.12 35.92,21.19 41.92,21.19 U5.12
PA15: length 19.4
  Top Layer w0.254: U2.38 42.9,22.75 U5.11
PB0: length 41
  Top Layer w0.254: U4.8 4.52,25.25 U2.18
  Bottom Layer w0.254: U4.8 5.06,21.67 5.06,6.97 6.48,5.54 LED1.3
PB1: length 19.2
  Top Layer w0.254: U4.7 6.56,24.75 U2.19
PB3: length 18.6
  Top Layer w0.254: U2.39 44.94,23.25 U5.10
PB4: length 17.8
  Top Layer w0.254: U5.9 29.27,23.73 U2.40
PB5: length 18.6
  Top Layer w0.254: U5.8 43.41,26.27 41.4,24.25 U2.41
PB6: length 60.7
  Top Layer w0.254: U2.42 41.25,24.75 43.23,26.73 43.24,26.73 45.32,28.81 U5.7
  Bottom Layer w0.254: H4.3 30.62,46.08 49,46.08 49.51,45.57 49.51,31.32 U5.7
PB7: length 56.1
  Top Layer w0.254: v1(43.67,43.03) v1(41,43.03) ; U5.6 40.9,25.25 U2.43
  Bottom Layer w0.254: v1(43.67,43.03) 43.67,41 44.47,40.2 47.9,40.2 48.37,39.73 48.37,32.72 U5.6 ; v1(41,43.03) 35.92,43.03 34.71,41.82 26.18,41.82 H4.4
PB8: length 20.9
  Top Layer w0.254: U2.45 39.36,26.25 U5.5
PB9: length 21.8
  Top Layer w0.254: U2.46 37.32,26.75 U5.4
PB10: length 19.9
  Top Layer w0.254: U4.6 8.1,23.75 U2.21 20.72,23.72
PB11: length 20.7
  Top Layer w0.254: U2.22 10.14,23.25 U4.5
PB12: length 22.6
  Top Layer w0.254: v1(16.11,18.14) 7.57,18.14 U4.4 ; v1(20.23,18.14) 22.25,20.17 U2.25
  Bottom Layer w0.254: v1(16.11,18.14) v1(20.23,18.14)
PB13: length 24.8
  Top Layer w0.254: U2.26 22.75,18.94 15.6,11.79 13.33,11.79 13.3,11.75 3.72,11.75 U4.3
PB14: length 26.5
  Top Layer w0.254: U2.27 23.25,18.68 13.06,8.49 U4.2
PB15: length 28.2
  Top Layer w0.254: U4.1 11.28,5.95 23.73,18.4 23.73,20.73 U2.28
PC13: length 24.6
  Top Layer w0.254: U2.2 27.25,30.68 28.18,31.6 39.63,31.6 U5.3
PC14: length 32.9
  Top Layer w0.254: U5.2 43.44,37.95 29.42,37.95 C6.2 X1.1 25.76,38.33 25.76,34.63 26.75,33.64 U2.3
PC15: length 38.5
  Top Layer w0.254: X1.2 C7.2 ; X1.2 23.85,39.35 24.62,40.11 25.7,40.11 25.74,40.15 27.06,40.15 27.1,40.11 43.06,40.11 U5.1 ; X1.2 25.31,37.52 25.31,34.44 26.25,33.5 U2.4
PD0: length 23.2
  Top Layer w0.254: v1(29.44,32.24) 34.02,32.24 34.53,32.75 34.53,34.02 33.64,34.91 X4.1 ; v1(26.14,27.16) 26.14,28.08 25.75,28.48 U2.5 25.78,29.22
  Bottom Layer w0.254: v1(29.44,32.24) 28.3,31.1 28.3,28.41 27.05,27.16 v1(26.14,27.16) ; R6.2 27.99,34.91 C8.2
  vias: v1(28.18,34.84)
PD1: length 16.6
  Top Layer w0.254: v1(22.33,34.91) X4.2 ; U2.6 25.25,26.65 24.75,26.14 v1(24.24,26.14)
  Bottom Layer w0.254: v1(24.24,26.14) 24.24,34.52 R6.1 22.52,34.91 C9.2
SWCLK: length 49
  Top Layer w0.254: v1(37.19,41.13) 37.19,47.99 35.54,49.64 24.62,49.64 23.73,48.75 H2.2 ; v1(31.86,22.08) 31.69,22.25 U2.37
  Bottom Layer w0.254: v1(31.86,22.08) 36.81,22.08 37.19,22.46 v1(37.19,41.13)
SWDIO: length 45.6
  Top Layer w0.254: v1(25.38,24.24) 25.38,22.89 26.75,21.52 U2.34 ; v1(13.7,38.59) 13.7,44.3 15.6,46.21 24.48,46.21 H2.3
  Bottom Layer w0.254: v1(13.7,38.59) 13.7,31.73 17.13,28.3 21.32,28.3 23.6,26.02 23.6,25.88 23.97,25.51 24.11,25.51 v1(25.38,24.24)
$1N1260: length 2.7
  Top Layer w0.254: H1.4 15.34,12.94 R1.1
$1N1311: length 2.6
  Top Layer w0.254: H1.3 7.86,12.94 7.73,13.07
$1N2229: length 9.1
  Top Layer w0.254: R3.2 19.59,6.16 19.79,5.95 19.79,4.49 20.24,4.04 22.33,4.04 23.75,5.46 USB1.4
$1N2235: length 9.2
  Top Layer w0.254: v1(31.48,8.74) 31.73,8.49 R4.2 ; v1(27.67,8.74) 26.75,7.83 USB1.10
  Bottom Layer w0.254: v1(31.48,8.74) v1(27.67,8.74)

## Copper pours and planes (outline as drawn; the poured copper is in the pictures)
GND on Top Layer: -1.92,52.05 52.31,52.05 52.31,-1.8 -1.92,-1.8
GND on Bottom Layer: -5.1,53.32 57,53.32 57,-3.45 -5.1,-3.45

Small or netless copper shapes (teardrops, artwork), in the pictures only: 206 on Top Layer, 85 on Bottom Layer
